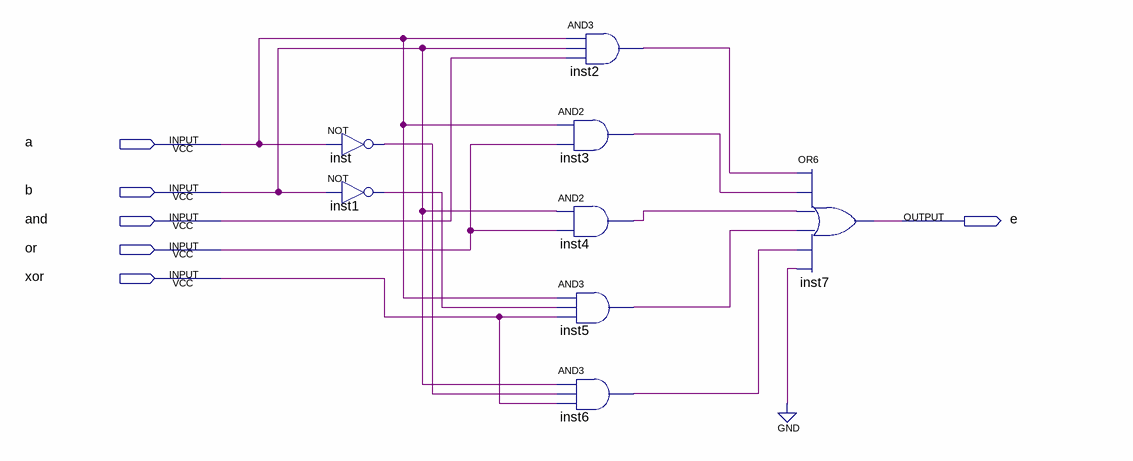
[diagram p0: schematic sheet]
// Quartus schematic experiment1.bdf as structural Verilog: 8 symbols, 6 pins
module experiment1 (
  input  a,
  input  b,
  input  \and ,
  input  \or ,
  input  \xor ,
  output e
);

  wire inst1_out, inst2_out, inst3_out, inst4_out, inst5_out, inst6_out, inst_out;

  not inst (inst_out, a);
  not inst1 (inst1_out, b);
  and inst2 (inst2_out, a, b, \and );
  and inst3 (inst3_out, a, \or );
  and inst4 (inst4_out, b, \or );
  and inst5 (inst5_out, a, inst1_out, \xor );
  and inst6 (inst6_out, b, inst_out, \xor );
  or inst7 (e, inst2_out, inst3_out, inst4_out, inst5_out, inst6_out, 1'b0);
endmodule
